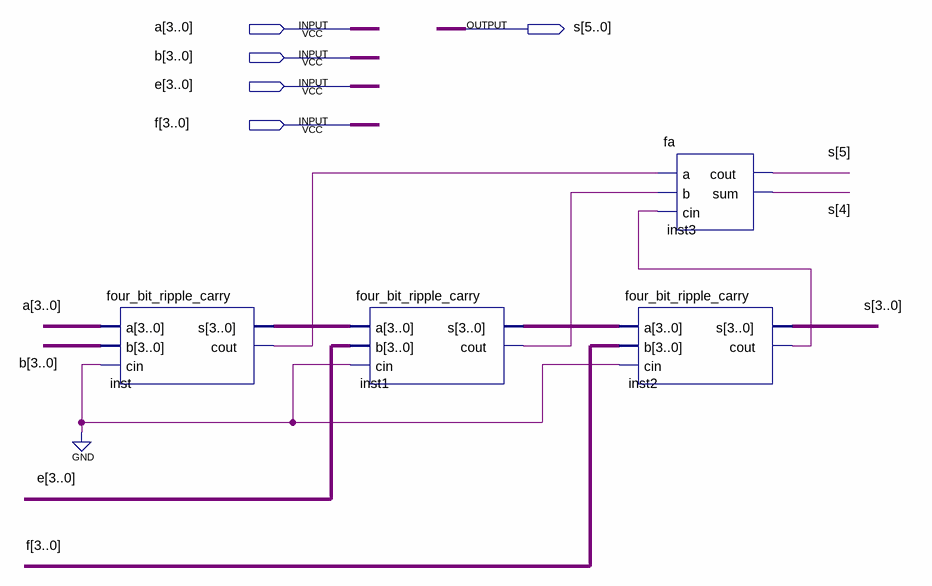
[diagram p0: schematic sheet]
// Quartus schematic four_number_rip_carry.bdf as structural Verilog: 4 symbols, 5 pins
module four_number_rip_carry (
  input  [3:0] a,
  input  [3:0] b,
  input  [3:0] e,
  input  [3:0] f,
  output [5:0] s
);

  wire inst1_cout, inst2_cout, inst_cout;
  wire [3:0] inst1_s, inst_s;

  four_bit_ripple_carry inst (.a(a), .b(b), .cin(1'b0), .s(inst_s), .cout(inst_cout));
  four_bit_ripple_carry inst1 (.a(inst_s), .b(e), .cin(1'b0), .s(inst1_s), .cout(inst1_cout));
  four_bit_ripple_carry inst2 (.a(inst1_s), .b(f), .cin(1'b0), .s(s[3:0]), .cout(inst2_cout));
  fa inst3 (.a(inst_cout), .b(inst1_cout), .cin(inst2_cout), .cout(s[5]), .sum(s[4]));
endmodule
